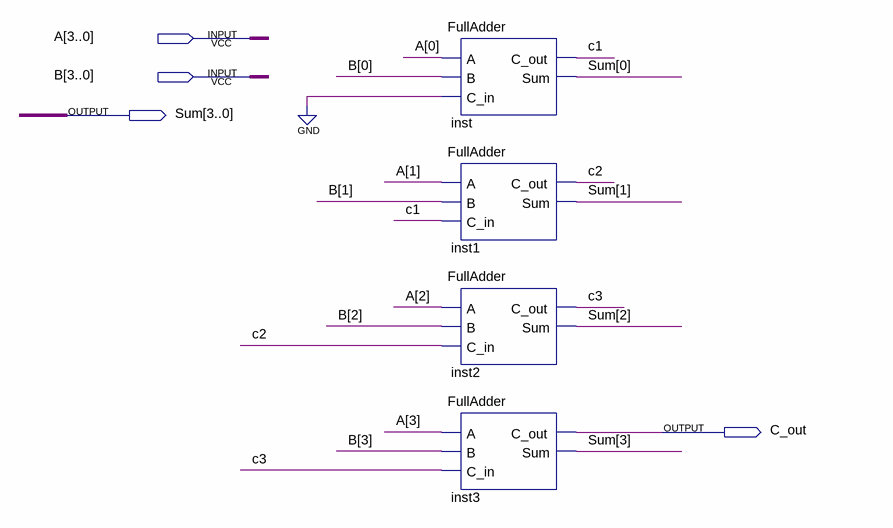
[diagram p0: schematic sheet]
// Quartus schematic 4BitFullAdder.bdf as structural Verilog: 4 symbols, 4 pins
module \4BitFullAdder  (
  input  [3:0] A,
  input  [3:0] B,
  output [3:0] Sum,
  output C_out
);

  wire c1, c2, c3;

  FullAdder inst (.A(A[0]), .B(B[0]), .C_in(1'b0), .C_out(c1), .Sum(Sum[0]));
  FullAdder inst1 (.A(A[1]), .B(B[1]), .C_in(c1), .C_out(c2), .Sum(Sum[1]));
  FullAdder inst2 (.A(A[2]), .B(B[2]), .C_in(c2), .C_out(c3), .Sum(Sum[2]));
  FullAdder inst3 (.A(A[3]), .B(B[3]), .C_in(c3), .C_out(C_out), .Sum(Sum[3]));
endmodule
